# EAGLE design minfinity (EAGLE 6.6.0)
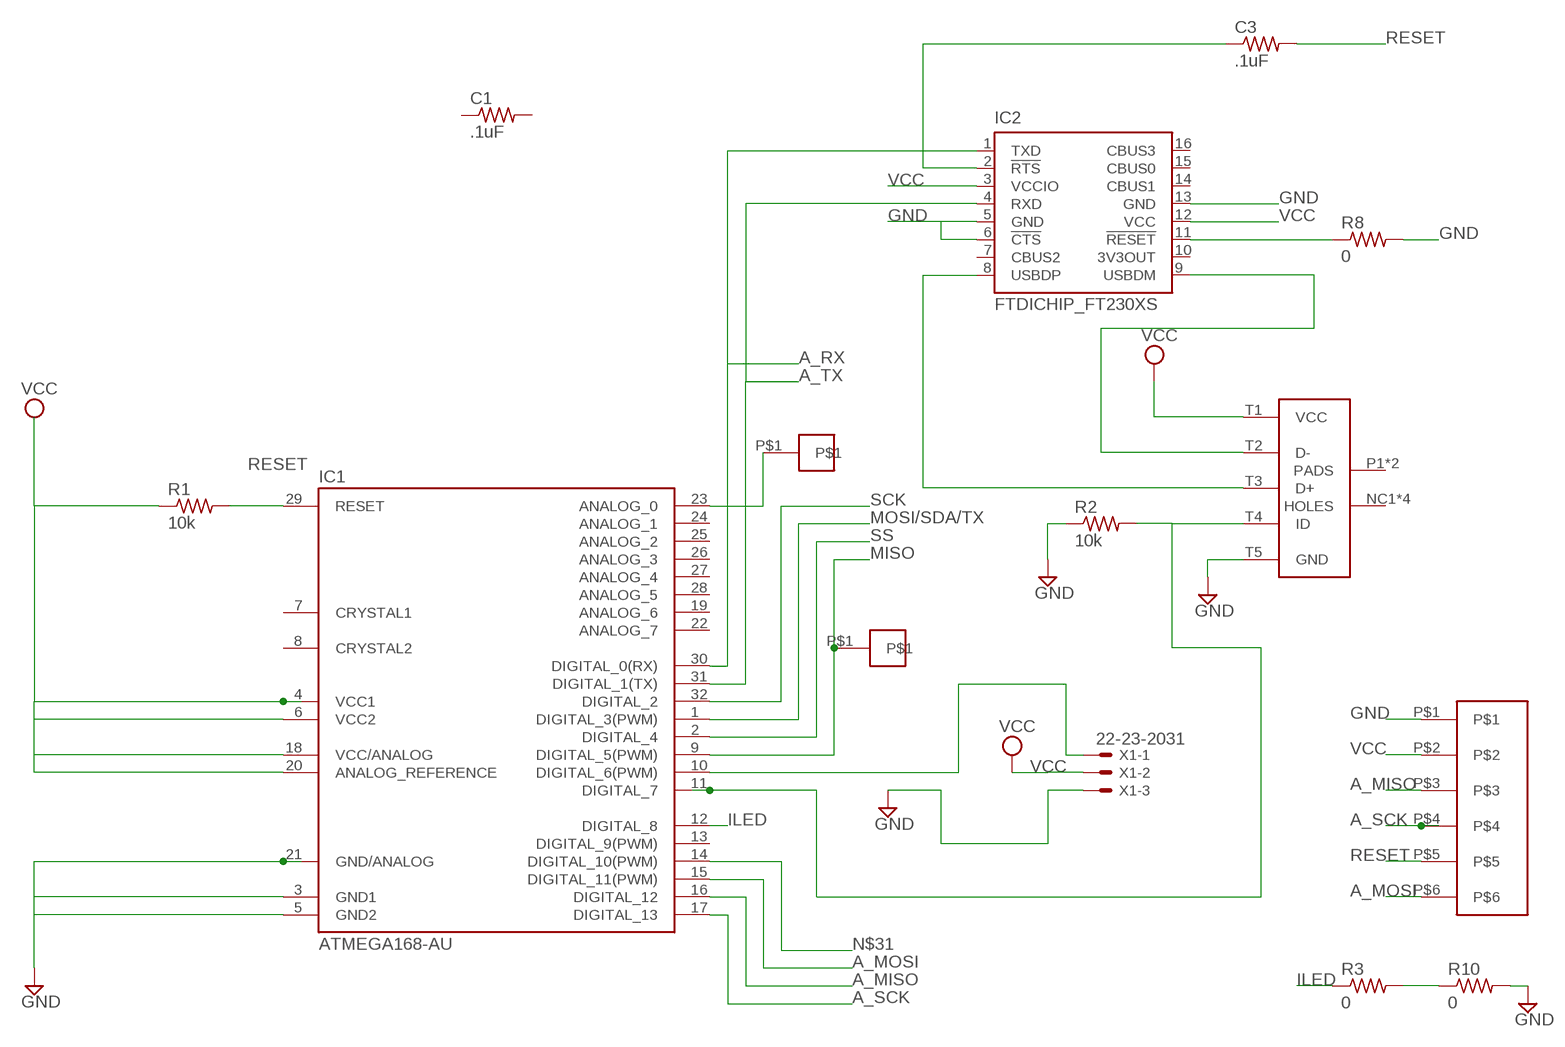
[diagram p0: schematic, sheet 1]

## Parts
C1  .1uF  SUPERKEVIN_R-US_R0805  [SUPERKEVIN_R0805]
C3  .1uF  SUPERKEVIN_R-US_R0805  [SUPERKEVIN_R0805]
IC1  ATMEGA168-AU  [TQFP32-08]
IC2  FTDICHIP_FT230XS  [FTDICHIP_SSOP16]
R1  10k  SUPERKEVIN_R-US_R0805  [SUPERKEVIN_R0805]
R2  10k  SUPERKEVIN_R-US_R0805  [SUPERKEVIN_R0805]
R3  0  SUPERKEVIN_R-US_R0805  [SUPERKEVIN_R0805]
R8  0  SUPERKEVIN_R-US_R0805  [SUPERKEVIN_R0805]
R10  0  SUPERKEVIN_R-US_R0805  [SUPERKEVIN_R0805]
U$1  TP  [TP]
U$2  SUPERKEVIN_609-4049-1  [SUPERKEVIN_609-4049-1]
U$7  RJ11  [RJ11-SMT]
U$16  TP  [TP]
X1  22-23-2031  [22-23-2031]

## Nets
A0: IC1.23(ANALOG_0) U$16.P$1
A_MISO: IC1.16(DIGITAL_12) U$7.P$3
A_MOSI: IC1.15(DIGITAL_11(PWM)) U$7.P$6
A_RX: IC1.30(DIGITAL_0(RX)) IC2.1(TXD)
A_SCK: IC1.17(DIGITAL_13) U$7.P$4
A_TX: IC1.31(DIGITAL_1(TX)) IC2.4(RXD)
GND: IC1.3(GND1) IC1.5(GND2) IC1.21(GND/ANALOG) IC2.5(GND) IC2.6(!CTS) IC2.13(GND) R2.1 R8.2 R10.2 U$2.T5(GND) U$7.P$1 X1.3
ILED: IC1.12(DIGITAL_8) R3.1
MISO: IC1.9(DIGITAL_5(PWM)) U$1.P$1
MOSI/SDA/TX: IC1.1(DIGITAL_3(PWM))
N$1: IC2.9(USBDM) U$2.T2(D-)
N$3: IC1.10(DIGITAL_6(PWM)) X1.1
N$4: IC1.11(DIGITAL_7) R2.2 U$2.T4(ID)
N$6: IC2.8(USBDP) U$2.T3(D+)
N$8: IC2.11(!RESET) R8.1
N$9: R3.2 R10.1
N$12: C3.1 IC2.2(!RTS)
N$31: IC1.14(DIGITAL_10(PWM))
RESET: C3.2 IC1.29(RESET) R1.2 U$7.P$5
SCK: IC1.32(DIGITAL_2)
SS: IC1.2(DIGITAL_4)
VCC: IC1.4(VCC1) IC1.6(VCC2) IC1.18(VCC/ANALOG) IC1.20(ANALOG_REFERENCE) IC2.3(VCCIO) IC2.12(VCC) R1.1 U$2.T1(VCC) U$7.P$2 X1.2
Unconnected: C1.1 C1.2 IC1.7(CRYSTAL1) IC1.8(CRYSTAL2) IC1.13(DIGITAL_9(PWM)) IC1.19(ANALOG_6) IC1.22(ANALOG_7) IC1.24(ANALOG_1) IC1.25(ANALOG_2) IC1.26(ANALOG_3) IC1.27(ANALOG_4) IC1.28(ANALOG_5) IC2.7(CBUS2) IC2.10(3V3OUT) IC2.14(CBUS1) IC2.15(CBUS0) IC2.16(CBUS3) U$2.NC1(HOLES) U$2.NC2(HOLES) U$2.NC3(HOLES) U$2.NC4(HOLES) U$2.P1(PADS) U$2.P2(PADS)

## Library data of the parts
C1 C3 R1-R3 R8 R10 = arini1:SUPERKEVIN_R-US_: RESISTOR, American symbol
IC1 = Arduino-AVR:ATMEGA168
IC2 = arini1:FTDICHIP_FT230X: USB to BASIC UART IC Auto generated by make-symbol-device-package-bsdl.ulp Rev. 43 Source: Data sheet <http://www.ftdichip.com/Support/Documents/DataSheets/ICs/DS_FT230X.pdf>
U$1 U$16 = superkevin:TP
U$2 = arini1:SUPERKEVIN_609-4049-1
U$7 = superkevin:RJ11
X1 = con-molex:22-23-2031: .100" (2.54mm) Center Header - 3 Pin; MF: MOLEX; MPN: 22-23-2031; OC_FARNELL: 1462950; OC_NEWARK: 30C0862

## Board
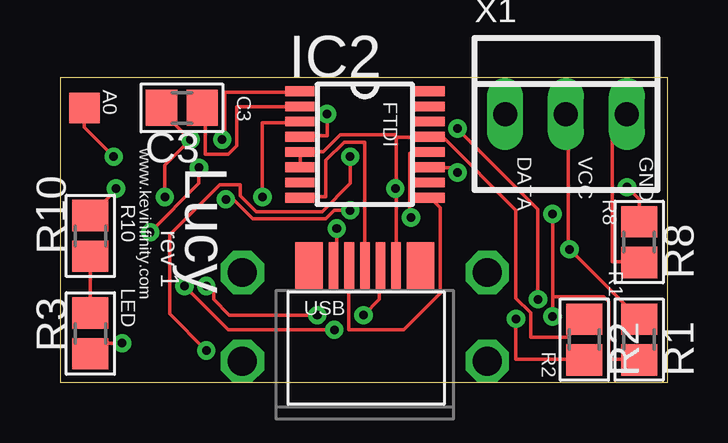
[diagram p1: board, top side]
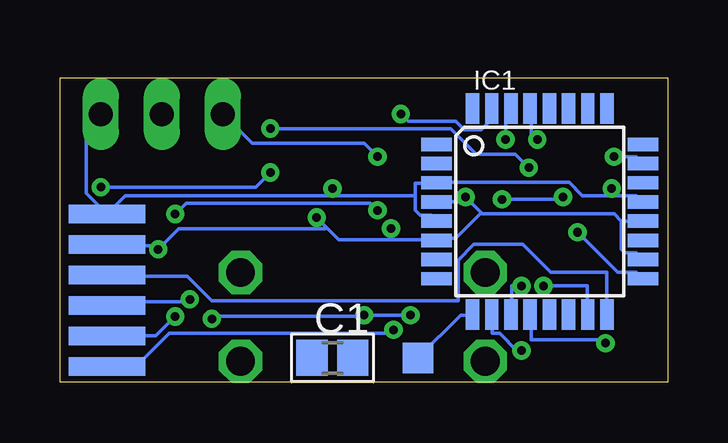
[diagram p2: board, bottom side, seen from below]

Size 25.32 x 12.69 mm. Coordinates in mm from the lower left corner, seen from the top.
Outline: 0,0 25.32,0 25.32,12.69 0,12.69 0,0
Copper layers (1*16): Top 0.0178mm / dielectric 59mil / Bottom 0.0178mm
Design rules "SSC-EAGLE-2Lyr_v1.0.0.3": minimum track width 6mil, minimum drill 14mil, track to track 6mil, track to pad 6mil, pad to pad 6mil, via to via 6mil, smd to smd 6mil, copper to edge 20mil, drill to drill 16mil, minimum pad ring 8mil, minimum via ring 8mil, stop-mask expansion 3mil, vias tented up to drill 0mil, thermal gap 10mil
vRestrict: area 21.8,0 to 30.2,3

### Footprints (pad centres in the part's own frame; a part is rotated, then mirrored left to right if it is on the bottom)
SUPERKEVIN_R0805 = smd 1.3 x 1.5: 1 -0.85,0; 2 0.85,0
TQFP32-08 = smd 1.27 x 0.559: 1 -4.293,2.8; 2 -4.293,2; 3 -4.293,1.2; 4 -4.293,0.4; 5 -4.293,-0.4; 6 -4.293,-1.2; 7 -4.293,-2; 8 -4.293,-2.8; 17 4.293,-2.8; 18 4.293,-2; 19 4.293,-1.2; 20 4.293,-0.4; 21 4.293,0.4; 22 4.293,1.2; 23 4.293,2; 24 4.293,2.8 | smd 0.559 x 1.27: 9 -2.8,-4.293; 10 -2,-4.293; 11 -1.2,-4.293; 12 -0.4,-4.293; 13 0.4,-4.293; 14 1.2,-4.293; 15 2,-4.293; 16 2.8,-4.293; 25 2.8,4.293; 26 2,4.293; 27 1.2,4.293; 28 0.4,4.293; 29 -0.4,4.293; 30 -1.2,4.293; 31 -2,4.293; 32 -2.8,4.293
FTDICHIP_SSOP16 = smd 1.214 x 0.406: 1 -2.718,2.223; 2 -2.718,1.587; 3 -2.718,0.953; 4 -2.718,0.318; 5 -2.718,-0.318; 6 -2.718,-0.953; 7 -2.718,-1.587; 8 -2.718,-2.223; 9 2.718,-2.223; 10 2.718,-1.587; 11 2.718,-0.953; 12 2.718,-0.318; 13 2.718,0.318; 14 2.718,0.953; 15 2.718,1.587; 16 2.718,2.223
TP = smd 1.27 x 1.27: P$1 0,0
SUPERKEVIN_609-4049-1 = drill 1.2 octagon: NC1 -5.1,0; NC2 5.1,0; NC3 -5.1,-3.7; NC4 5.1,-3.7 | smd 1.15 x 2: P1 -2.325,0.25; P2 2.325,0.25 | smd 0.4 x 2: T1 -1.3,0.25; T2 -0.65,0.25; T3 0,0.25; T4 0.65,0.25; T5 1.3,0.25
RJ11-SMT = smd 0.76 x 3.2: P$1 -3.2,0; P$2 -1.93,0; P$3 -0.66,0; P$4 0.61,0; P$5 1.88,0; P$6 3.15,0
22-23-2031 = drill 1 long: 1 -2.54,0; 2 0,0; 3 2.54,0

### Placement (x,y rotation side)
C1  13.97,1.02 0 bottom
C3  5.08,11.43 180 top
IC1  5.33,7.11 0 bottom
IC2  12.7,9.91 0 top
R1  24.13,1.78 270 top
R2  21.84,1.78 270 top
R3  1.27,2.03 90 top
R8  24.13,5.84 270 top
R10  1.27,6.1 90 top
U$1  10.41,1.02 0 bottom
U$2  12.7,4.57 0 top
U$7  23.37,3.81 270 bottom
U$16  1.02,11.43 0 top
X1  21.08,11.18 0 top

### Tracks (layer width: path | path; a pad name or v marks a point on that pad's centre or on a via)
A0  (via drill 0.36)
  Top 0.152: v2.23,9.4 1.02,10.62 U$16.P$1
  Bottom 0.152: v2.23,9.4 1.32,9.4 1.07,9.14 IC1.23
A_MISO
  Bottom 0.152: IC1.16 2.54,2.85 2.54,4.57 4.88,4.57 6.04,5.74 8.08,5.74 8.74,5.08 8.74,3.4 19,3.4 20.02,4.42 23.37,4.42 U$7.P$3
A_MOSI  (via drill 0.36)
  Top 0.152: v5.18,4.01 7.01,2.18 v11.43,2.18
  Bottom 0.152: v5.18,4.01 3.35,4.01 3.35,2.85 IC1.15 | v11.43,2.18 11.58,2.03 20.78,2.03 22.15,0.66 U$7.P$6 | U$7.P$6
A_RX  (via drill 0.36)
  Top 0.152: v6.76,10.11 6.86,10.21 6.86,12.09 9.96,12.09 IC2.1
  Bottom 0.152: v6.76,10.11 6.76,11.38 6.55,11.38 IC1.30
A_SCK  (via drill 0.36)
  Top 0.152: v3.76,6.25 5.79,8.28 v5.79,8.94 | v16.56,10.57 19.91,7.21 v19.91,3.45
  Bottom 0.152: v3.76,6.25 2.08,4.57 1.32,4.57 1.07,4.32 IC1.17 | v5.79,8.94 6.35,9.5 7.98,9.5 9.04,10.57 v16.56,10.57 | v19.91,3.45 20.02,3.35 23.22,3.35 U$7.P$4 | U$7.P$4
A_TX  (via drill 0.36)
  Top 0.152: v11.12,11.18 11.12,10.26 10.01,10.26 IC2.4
  Bottom 0.152: v11.12,11.18 10.82,10.87 8.84,10.87 8.48,10.52 7.77,10.52 7.37,10.92 7.37,11.38 IC1.31
GND  (via drill 0.36)
  Top 0.152: IC2.6 10.01,8.99 10.01,9.55 IC2.5 10.06,9.6 10.97,9.6 11.68,10.31 13.97,10.31 13.97,10.26 14.02,10.21 | 14.02,10.21 15.39,10.21 IC2.13 15.44,10.16 16,10.16 19,7.16 19,3.5 19.61,2.9 19.61,1.88 21.13,1.88 21.84,2.59 R2.1 | 14.02,8.08 14.02,4.83 U$2.T5 | 14.02,8.08 14.02,10.21 | v2.34,8.08 2.34,8.03 R10.2 | X1.3 23.01,10.57 23.01,5.03 24.13,5.03 R8.2 | v13.97,8.08 14.02,8.08
  Bottom 0.152: 10.52,7.77 10.52,8.28 9.65,8.28 IC1.3 9.6,8.33 4.12,8.33 3.56,7.77 2.34,7.77 | 10.52,7.77 10.52,7.16 10.31,6.96 9.86,6.96 9.65,6.76 IC1.5 | 2.34,7.77 1.32,7.77 1.07,7.52 IC1.21 | 2.34,7.77 v2.34,8.08 | U$7.P$1 24.23,7.87 24.23,11.18 X1.3 | U$7.P$1 | 13.97,7.77 22.61,7.77 23.32,7.06 U$7.P$1 | 13.97,7.77 10.52,7.77 | 13.97,7.77 v13.97,8.08
ILED  (via drill 0.36)
  Top 0.152: v2.59,1.63 1.27,1.63 R3.1
  Bottom 0.152: v2.59,1.63 2.74,1.78 5.69,1.78 5.69,2.79 IC1.12
MISO
  Bottom 0.152: U$1.P$1 8.64,2.79 8.18,2.79 IC1.9
N$1
  Top 0.152: IC2.9 15.44,7.67 15.85,7.26 15.85,3.71 14.33,2.18 12.04,2.18 12.04,4.78 U$2.T2
N$3  (via drill 0.36)
  Top 0.152: v6.1,1.32 4.57,2.85 4.57,6.15 6.66,8.23 7.52,8.23 7.52,7.77 8.18,7.11 10.92,7.11 12.09,8.28 v12.09,9.4
  Bottom 0.152: v6.1,1.32 6.3,1.32 7.01,2.03 7.32,2.03 7.32,2.79 IC1.10 | v12.09,9.4 12.65,9.96 17.32,9.96 X1.1
N$4  (via drill 0.36)
  Top 0.152: v6.1,4.01 6.4,3.71 6.4,3.45 7.06,2.79 v10.72,2.79 | v12.65,2.79 13.31,3.45 13.31,4.78 U$2.T4 | v19,2.64 19,0.96 21.84,0.96 R2.2
  Bottom 0.152: v6.1,4.01 6.5,4.01 6.5,2.85 IC1.11 | v10.72,2.79 v12.65,2.79 12.7,2.74 18.9,2.74 v19,2.64
N$6
  Top 0.152: U$2.T3 12.7,10.01 11.84,10.01 11.07,9.25 11.07,7.72 10.01,7.72 IC2.8
N$8  (via drill 0.36)
  Top 0.152: v16.56,8.74 16.56,8.94 15.44,8.94 IC2.11 | v23.62,8.13 24.13,7.62 R8.1
  Bottom 0.152: v16.56,8.74 17.17,8.13 v23.62,8.13
N$9
  Top 0.152: R10.1 R3.2
N$12
  Top 0.152: IC2.2 9.96,11.48 7.37,11.48 7.37,9.86 7.01,9.5 6.04,9.5 6.04,11.33 5.94,11.43 C3.1
RESET  (via drill 0.36)
  Top 0.152: C3.2 4.27,11.43 4.27,11.28 v5.44,10.11 4.37,9.04 v4.37,7.72 | 20.52,3.56 22.66,3.56 22.86,3.35 22.86,0.96 24.13,0.96 R1.2 | v20.52,2.74 20.52,3.56 | v6.91,7.62 7.21,7.62 8.03,6.81 11.07,6.81 11.43,7.16 v12.09,7.16 | 20.52,3.56 v20.52,7.01
  Bottom 0.152: v5.44,10.11 5.69,10.11 5.69,11.38 IC1.29 | v20.52,2.74 21.34,1.93 U$7.P$5 | U$7.P$5 | v4.37,7.72 4.47,7.62 v6.91,7.62 | v12.09,7.16 12.39,7.47 20.07,7.47 v20.52,7.01
VCC  (via drill 0.36)
  Top 0.152: v8.43,7.72 8.43,10.82 9.96,10.82 IC2.3 | R1.1 24.13,2.64 v21.23,5.54 21.18,5.59 21.18,11.07 X1.2 | v14.63,6.86 14.58,6.91 14.58,9.55 15.39,9.55 IC2.12 | v11.53,6.4 11.53,4.93 11.43,4.83 U$2.T1
  Bottom 0.152: 1.93,6.71 1.93,5.54 1.78,5.38 1.32,5.38 1.07,5.13 IC1.18 | 1.93,6.71 1.07,6.71 IC1.20 | IC1.4 9.6,7.52 8.64,7.52 v8.43,7.72 7.77,7.06 | 1.93,6.71 2.23,7.01 7.72,7.01 7.77,7.06 | U$7.P$2 23.37,5.69 21.39,5.69 v21.23,5.54 20.37,6.4 14.28,6.4 14.22,6.45 | 14.22,6.45 13.72,5.94 11.53,5.94 | 14.22,6.45 v14.63,6.86 | 11.53,5.94 9.65,5.94 IC1.6 9.6,5.99 8.84,5.99 7.77,7.06 | 11.53,5.94 v11.53,6.4

### Text on the board
tPlace: A0 | C3 | FTDI | DATA | VCC | GND | R8 | www.kevinfinity.com | R10 | rev 1 | Lucy | R1 | USB | LED | R2